# Altium schematic sheet powersupply.SchDoc
size A4; SheetNumber: 1; SheetTotal: 1
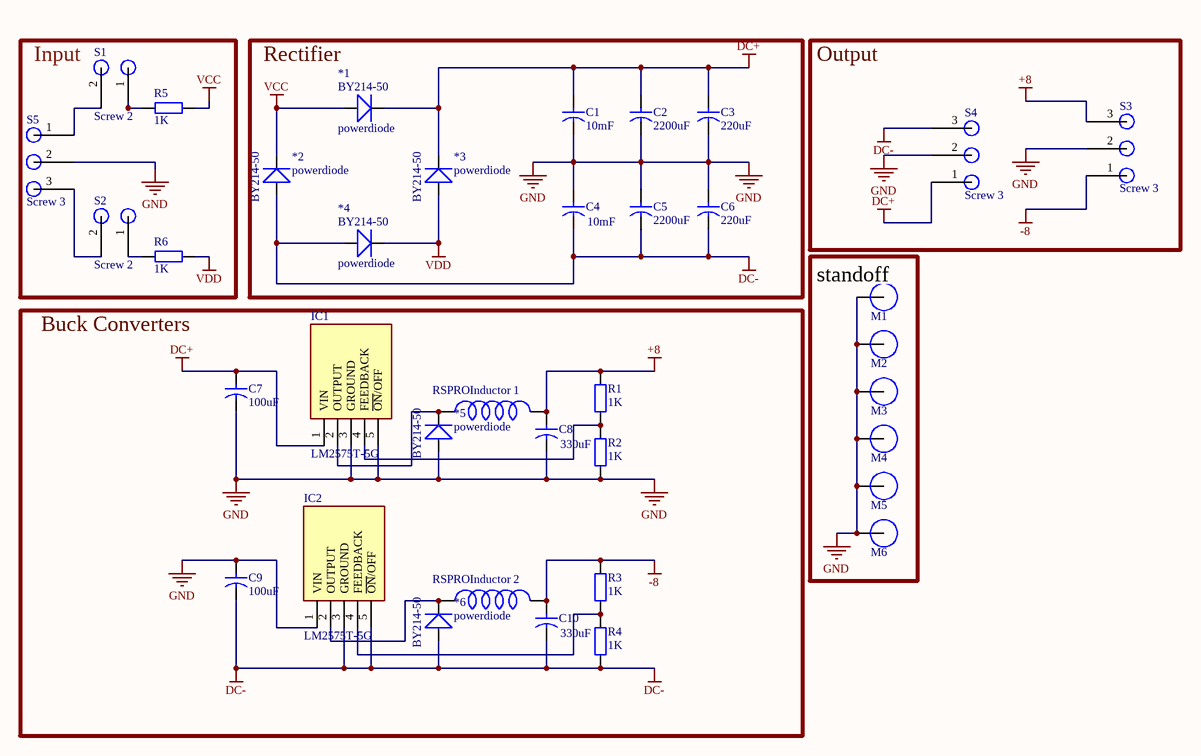
[diagram p0: powersupply.SchDoc]

## Parts
1  RSPROInductor  [RS PRO inductor]
2  RSPROInductor  [RS PRO inductor]
*1  powerdiode  [BY214-50]
*2  powerdiode  [BY214-50]
*3  powerdiode  [BY214-50]
*4  powerdiode  [BY214-50]
*5  powerdiode  [BY214-50]
*6  powerdiode  [BY214-50]
C1  Capacity: 10mF  [Cap Lyt Ø30]  (hidden comment: Cap)
C2  Capacity: 2200uF  [Cap Lyt Ø18]  (hidden comment: Cap)
C3  Capacity: 220uF  [Cap Lyt Ø8]  (hidden comment: Cap)
C4  Capacity: 10mF  [Cap Lyt Ø30]  (hidden comment: Cap)
C5  Capacity: 2200uF  [Cap Lyt Ø18]  (hidden comment: Cap)
C6  Capacity: 220uF  [Cap Lyt Ø8]  (hidden comment: Cap)
C7  Capacity: 100uF  [Cap Lyt Ø8]  (hidden comment: Cap)
C8  Capacity: 330uF  [Cap Lyt Ø8]  (hidden comment: Cap)
C9  Capacity: 100uF  [Cap Lyt Ø8]  (hidden comment: Cap)
C10  Capacity: 330uF  [Cap Lyt Ø8]  (hidden comment: Cap)
IC1  LM2575T-5G  [LM2575T5G]
IC2  LM2575T-5G  [LM2575T5G]
M1  Screw Hole  [M3 Hole]  (value not drawn)
M2  Screw Hole  [M3 Hole]  (value not drawn)
M3  Screw Hole  [M3 Hole]  (value not drawn)
M4  Screw Hole  [M3 Hole]  (value not drawn)
M5  Screw Hole  [M3 Hole]  (value not drawn)
M6  Screw Hole  [M3 Hole]  (value not drawn)
R1  Ohm: 1K  [RES THT 9mm]  (hidden comment: Resistor)
R2  Ohm: 1K  [RES THT 9mm]  (hidden comment: Resistor)
R3  Ohm: 1K  [RES THT 9mm]  (hidden comment: Resistor)
R4  Ohm: 1K  [RES THT 9mm]  (hidden comment: Resistor)
R5  Ohm: 1K  [RES THT 9mm]  (hidden comment: Resistor)
R6  Ohm: 1K  [RES THT 9mm]  (hidden comment: Resistor)
S1  Screw 2  [Screw-2]
S2  Screw 2  [Screw-2]
S3  Screw 3  [Screw-3]
S4  Screw 3  [Screw-3]
S5  Screw 3  [Screw-3]

## Blocks framed on the sheet
Input: R5 R6 S1 S2 S5
Rectifier: *1-*4 C1-C6
Output: S3 S4
Buck Converters: 1 2 *5 *6 C7-C10 IC1 IC2 R1-R4

## Nets
+8: 1.2 C8.1 R1.2 S3.3
-8: 2.2 C10.1 R3.2 S3.1
DC+: *1.2 *3.2 C1.1 C2.1 C3.1 C7.1 IC1.1(VIN) S4.1
DC-: *2.1 *4.1 *6.1 C4.2(g) C5.2(g) C6.2(g) C9.2(g) C10.2(g) IC2.3(GROUND) IC2.5(~{ON}/OFF) R4.1 S4.3
GND: *5.1 C1.2(g) C2.2(g) C3.2(g) C4.1 C5.1 C6.1 C7.2(g) C8.2(g) C9.1 IC1.3(GROUND) IC1.5(~{ON}/OFF) IC2.1(VIN) M1.1 M2.1 M3.1 M4.1 M5.1 M6.1 R2.1 S3.2 S4.2 S5.2
VCC: *1.1 *2.2 R5.1
VDD: *3.1 *4.2 R6.1
Net1_1: 1.1 *5.2 IC1.2(OUTPUT)
Net2_1: 2.1 *6.2 IC2.2(OUTPUT)
NetIC1_4: IC1.4(FEEDBACK) R1.1 R2.2
NetIC2_4: IC2.4(FEEDBACK) R3.1 R4.2
NetR5_2: R5.2 S1.1
NetR6_2: R6.2 S2.1
NetS1_2: S1.2 S5.1
NetS2_2: S2.2 S5.3

## Notes on the sheet
- (near M1) standoff
- (in symbol powerdiode) BY214-50

## Library data of the parts
1 2 = homemade inductor
*1-*6 = powerdiode: 50V/6A Powerdiode
C1-C10 = Capacitor electrolytic
IC1 IC2 = LM2575T-5G: Integrated Circuit; Manufacturer_Name: onsemi; Datasheet Link: https://www.onsemi.com/pdf/datasheet/lm2575-d.pdf; Height: 15.57mm; Manufacturer_Part_Number: LM2575T-5G; Mouser Part Number: 863-LM2575T-5G; Mouser Price/Stock: https://www.mouser.co.uk/ProductDetail/onsemi/LM2575T-5G?qs=2OtswVQKCOGF4zi2cBc3%2FQ%3D%3D; Arrow Part Number: LM2575T-5G; Arrow Price/Stock: https://www.arrow.com/en/products/lm2575t-5g/on-semiconductor?region=nac